# EAGLE design io_shield_v1.2 (EAGLE 5.11)
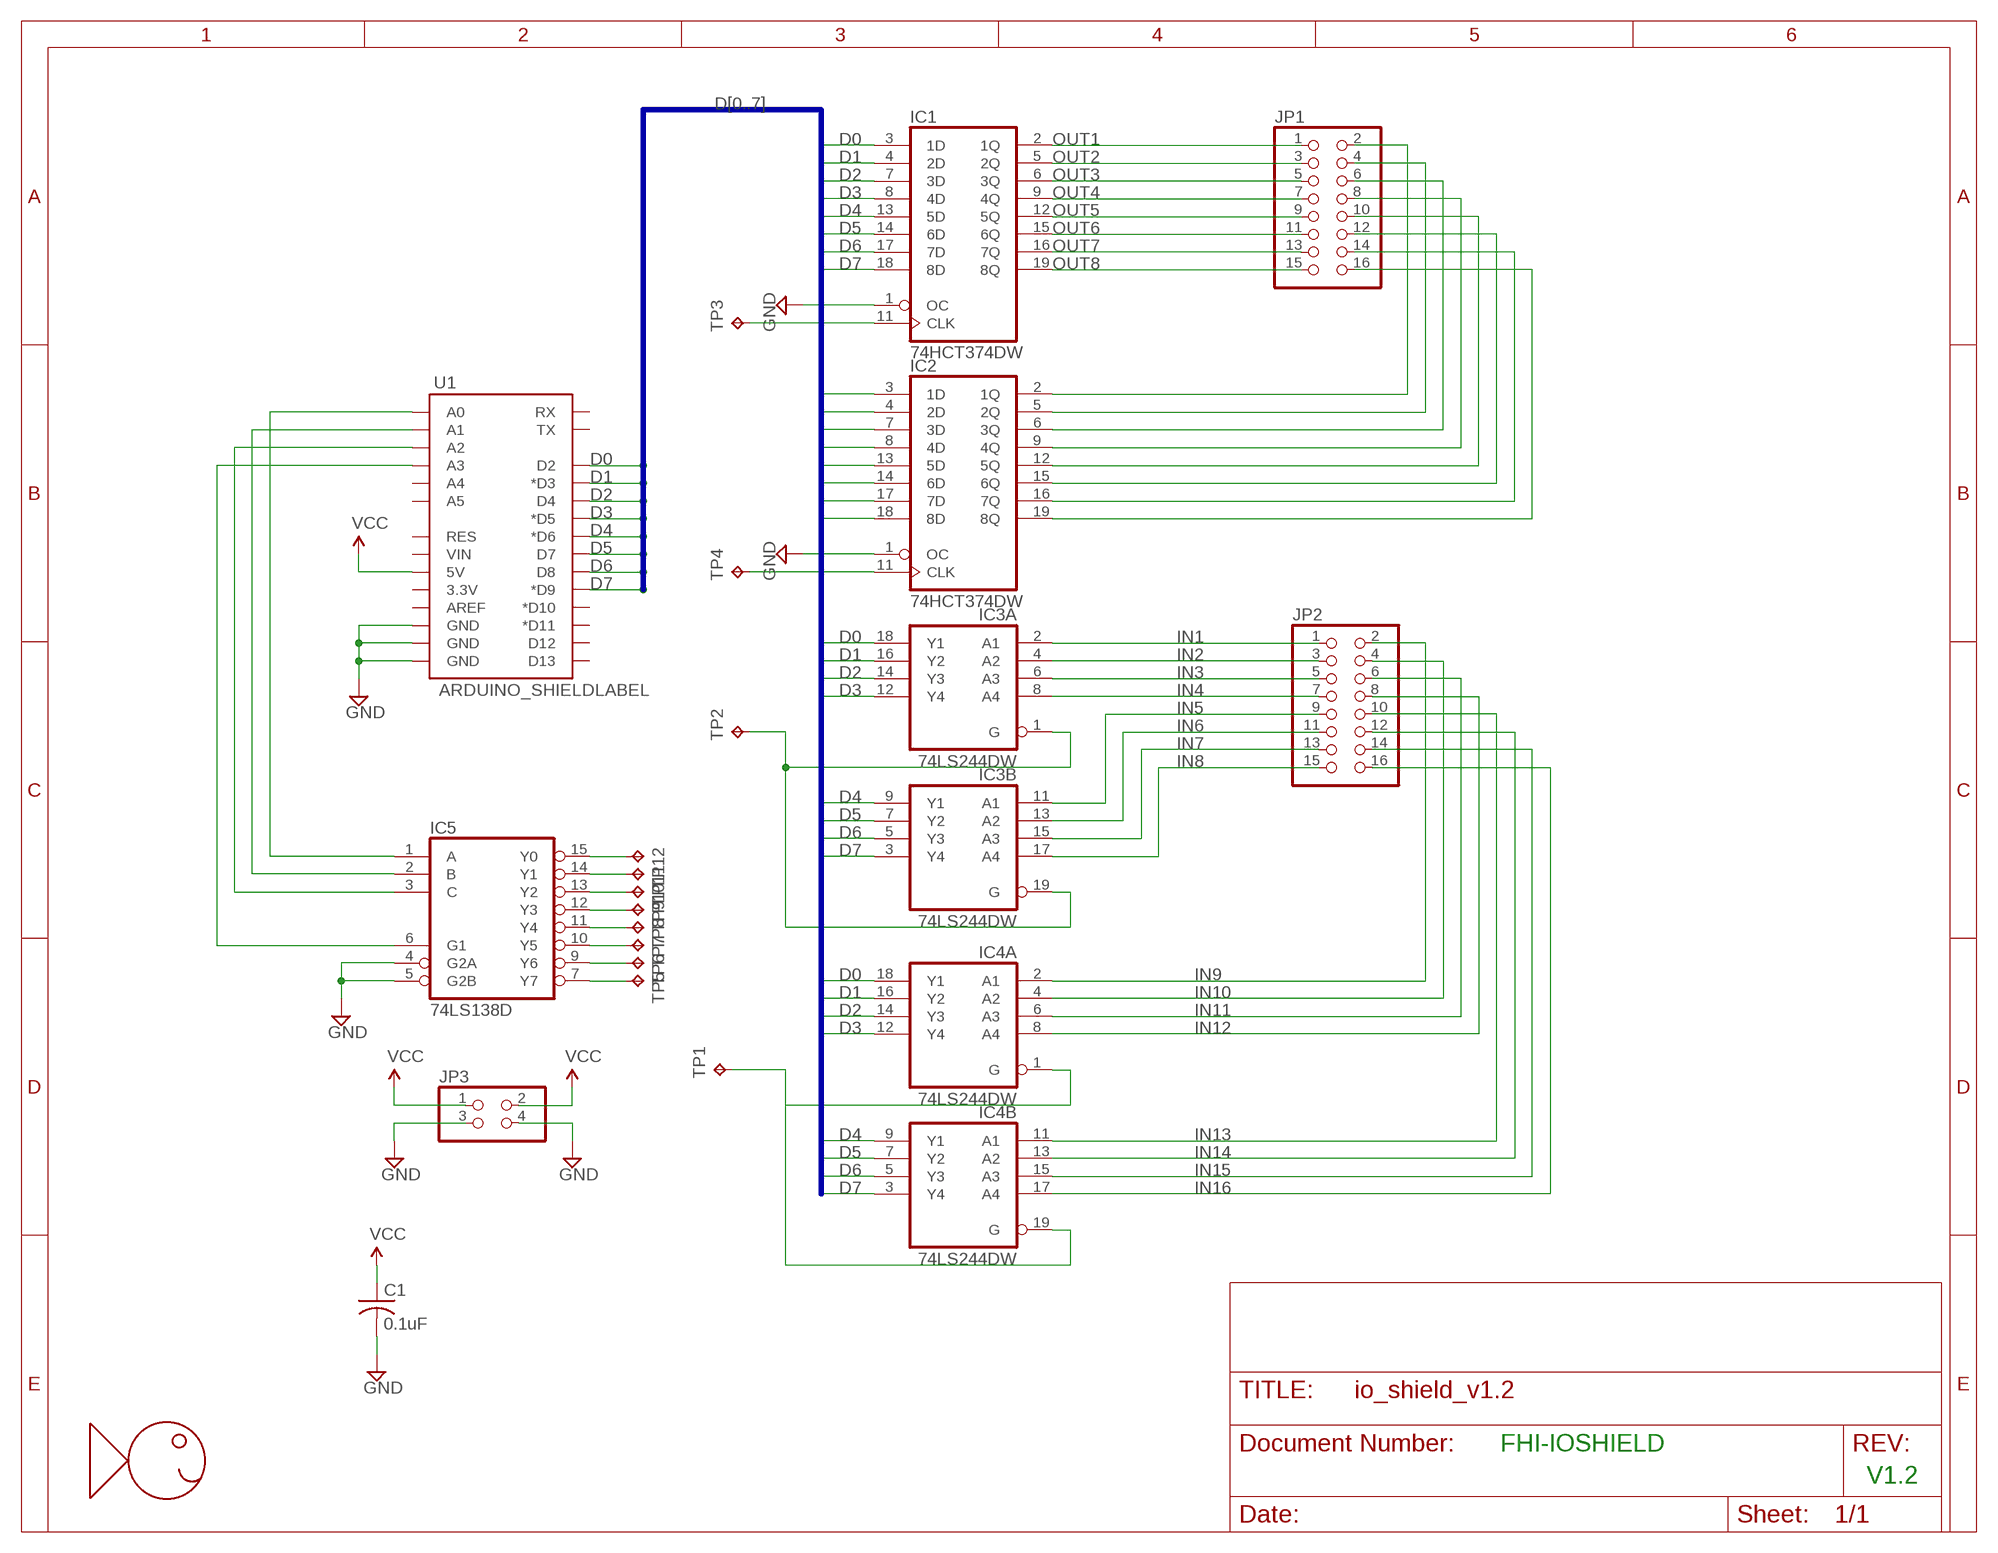
[diagram p0: schematic, sheet 1]

## Parts
C1  0.1uF  C-US025-025X050  [C025-025X050]
IC1  74HCT374DW  [SO20W]
IC2  74HCT374DW  [SO20W]
IC3  74LS244DW  [SO20W]
IC4  74LS244DW  [SO20W]
IC5  74LS138D  [SO16]
JP1  PINHD-2X8/90  [2X08/90]
JP2  PINHD-2X8/90  [2X08/90]
JP3  PINHD-2X2/90  [2X02/90]
TP1  TPTP12SQ  [TP12SQ]
TP2  TPTP12SQ  [TP12SQ]
TP3  TPTP12SQ  [TP12SQ]
TP4  TPTP12SQ  [TP12SQ]
TP5  TPTP12SQ  [TP12SQ]
TP6  TPTP12SQ  [TP12SQ]
TP7  TPTP12SQ  [TP12SQ]
TP8  TPTP12SQ  [TP12SQ]
TP9  TPTP12SQ  [TP12SQ]
TP10  TPTP12SQ  [TP12SQ]
TP11  TPTP12SQ  [TP12SQ]
TP12  TPTP12SQ  [TP12SQ]
U1  ARDUINO_SHIELDLABEL  [DUEMILANOVE_SHIELD]
U$1  FHI_LOGO  [FHI_LOGO]

## Nets
A0: IC5.1(A) U1.A0
A1: IC5.2(B) U1.A1
A2: IC5.3(C) U1.A2
D0: IC1.3(1D) IC2.3(1D) IC3.18(A:Y1) IC4.18(A:Y1) U1.D2
D1: IC1.4(2D) IC2.4(2D) IC3.16(A:Y2) IC4.16(A:Y2) U1.D3(*D3)
D2: IC1.7(3D) IC2.7(3D) IC3.14(A:Y3) IC4.14(A:Y3) U1.D4
D3: IC1.8(4D) IC2.8(4D) IC3.12(A:Y4) IC4.12(A:Y4) U1.D5(*D5)
D4: IC1.13(5D) IC2.13(5D) IC3.9(B:Y1) IC4.9(B:Y1) U1.D6(*D6)
D5: IC1.14(6D) IC2.14(6D) IC3.7(B:Y2) IC4.7(B:Y2) U1.D7
D6: IC1.17(7D) IC2.17(7D) IC3.5(B:Y3) IC4.5(B:Y3) U1.D8
D7: IC1.18(8D) IC2.18(8D) IC3.3(B:Y4) IC4.3(B:Y4) U1.D9(*D9)
EN0: IC5.15(Y0) TP12.TP
EN1: IC5.14(Y1) TP11.TP
EN2: IC5.13(Y2) TP10.TP
EN3: IC5.12(Y3) TP9.TP
EN4: IC5.11(Y4) TP8.TP
EN5: IC5.10(Y5) TP7.TP
EN6: IC5.9(Y6) TP6.TP
EN7: IC5.7(Y7) TP5.TP
GND: C1.2 IC1.1(OC) IC2.1(OC) IC5.4(G2A) IC5.5(G2B) JP3.3 JP3.4 U1.GND@0(GND) U1.GND@1(GND) U1.GND@2(GND)
IN1: IC3.2(A:A1) JP2.1
IN1_EN: IC3.1(A:G) IC3.19(B:G) TP2.TP
IN2: IC3.4(A:A2) JP2.3
IN2_EN: IC4.1(A:G) IC4.19(B:G) TP1.TP
IN3: IC3.6(A:A3) JP2.5
IN4: IC3.8(A:A4) JP2.7
IN5: IC3.11(B:A1) JP2.9
IN6: IC3.13(B:A2) JP2.11
IN7: IC3.15(B:A3) JP2.13
IN8: IC3.17(B:A4) JP2.15
IN9: IC4.2(A:A1) JP2.2
IN10: IC4.4(A:A2) JP2.4
IN11: IC4.6(A:A3) JP2.6
IN12: IC4.8(A:A4) JP2.8
IN13: IC4.11(B:A1) JP2.10
IN14: IC4.13(B:A2) JP2.12
IN15: IC4.15(B:A3) JP2.14
IN16: IC4.17(B:A4) JP2.16
IO_EN: IC5.6(G1) U1.A3
OUT1: IC1.2(1Q) JP1.1
OUT1_EN: IC1.11(CLK) TP3.TP
OUT2: IC1.5(2Q) JP1.3
OUT2_EN: IC2.11(CLK) TP4.TP
OUT3: IC1.6(3Q) JP1.5
OUT4: IC1.9(4Q) JP1.7
OUT5: IC1.12(5Q) JP1.9
OUT6: IC1.15(6Q) JP1.11
OUT7: IC1.16(7Q) JP1.13
OUT8: IC1.19(8Q) JP1.15
OUT9: IC2.2(1Q) JP1.2
OUT10: IC2.5(2Q) JP1.4
OUT11: IC2.6(3Q) JP1.6
OUT12: IC2.9(4Q) JP1.8
OUT13: IC2.12(5Q) JP1.10
OUT14: IC2.15(6Q) JP1.12
OUT15: IC2.16(7Q) JP1.14
OUT16: IC2.19(8Q) JP1.16
VCC: C1.1 JP3.1 JP3.2 U1.5V
Unconnected: U1.3.3V U1.A4 U1.A5 U1.AREF U1.D10(*D10) U1.D11(*D11) U1.D12 U1.D13 U1.RES U1.RX U1.TX U1.VIN

## Buses
D[0..7]

## Notes on the sheet
- FHI-IOSHIELD
- V1.2

## Power pins joined to a net without a drawn wire
GND: IC1.10(GND) IC2.10(GND) IC3.10(P:GND) IC4.10(P:GND) IC5.8(GND)
VCC: IC1.20(VCC) IC2.20(VCC) IC3.20(P:VCC) IC4.20(P:VCC) IC5.16(VCC)

## Library data of the parts
C1 = rcl:C-US: CAPACITOR, American symbol
IC1 IC2 = 74xx-eu:74*374: Octal D type transparent LATCH, edge triggered
IC3 IC4 = 74xx-us:74*244: Octal BUFFER and LINE DRIVER, 3-state
IC5 = 74xx-us:74*138: 3-line to 8-line DECODER/DEMULTIPLEXER
JP1 JP2 = pinhead:PINHD-2X8: PIN HEADER
JP3 = pinhead:PINHD-2X2: PIN HEADER
TP1-TP12 = testpad:TP: Test pad
U1 = SparkFun:ARDUINO_SHIELD
U$1 = CyberRailGuru:FHI_LOGO: Fishhead Industries Logo

## Board
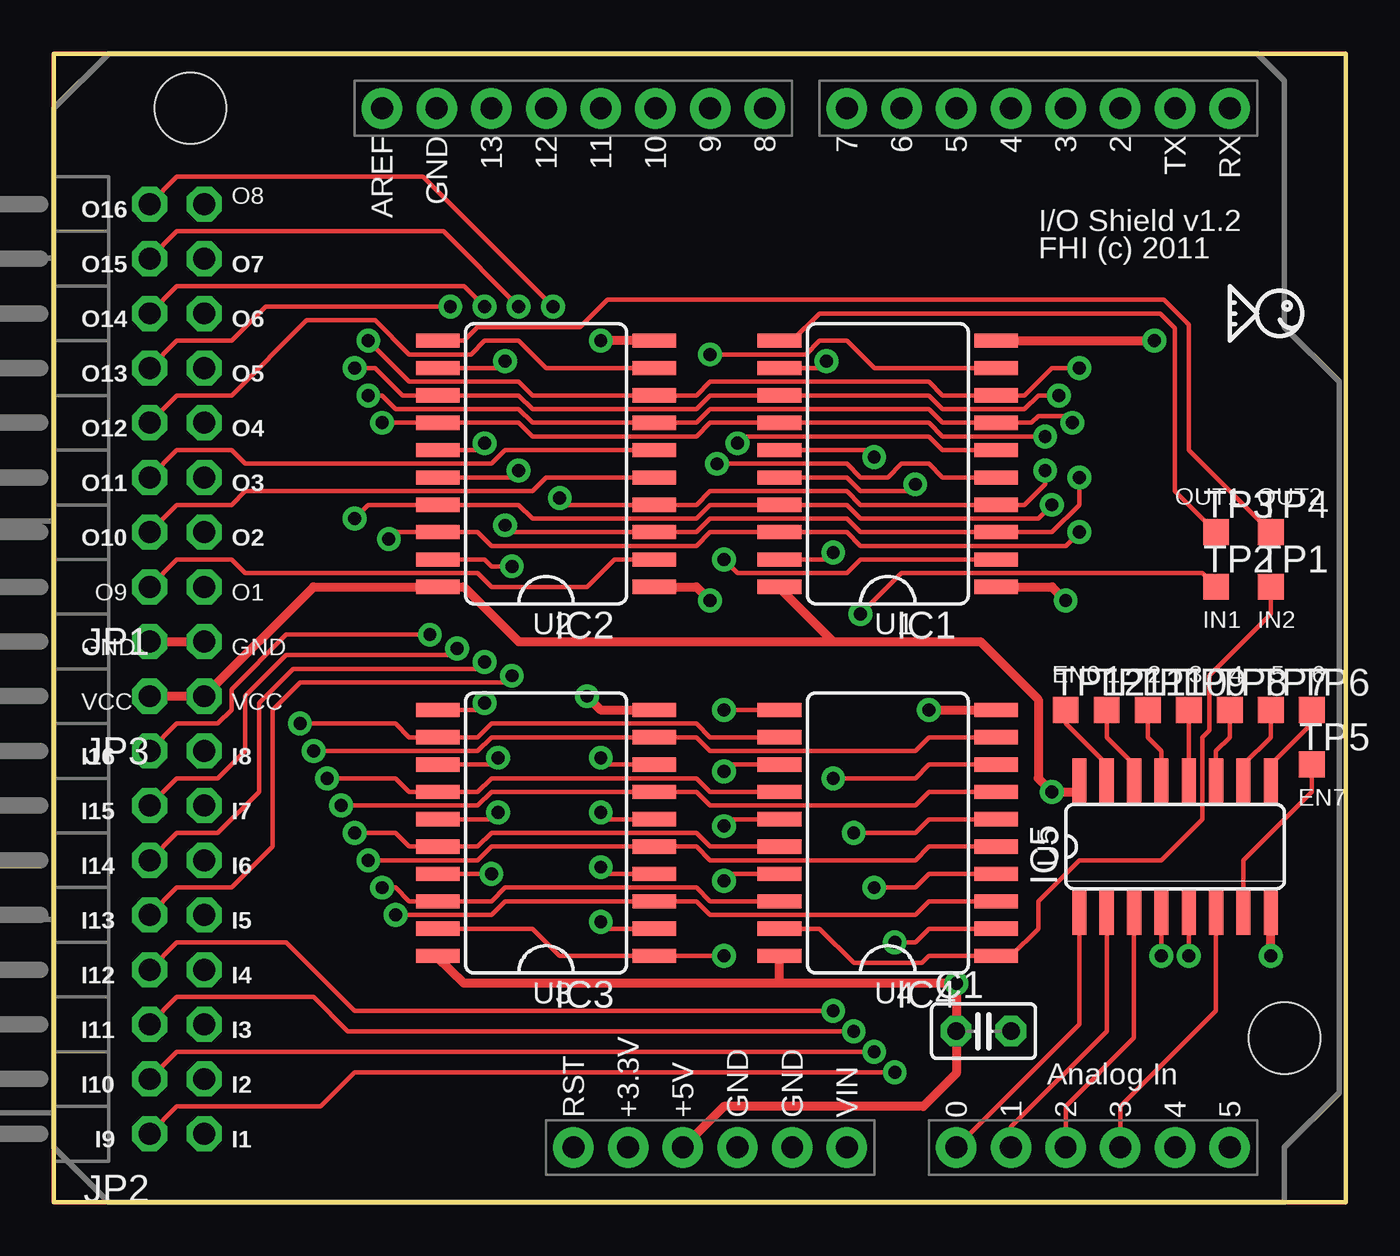
[diagram p1: board, top side]
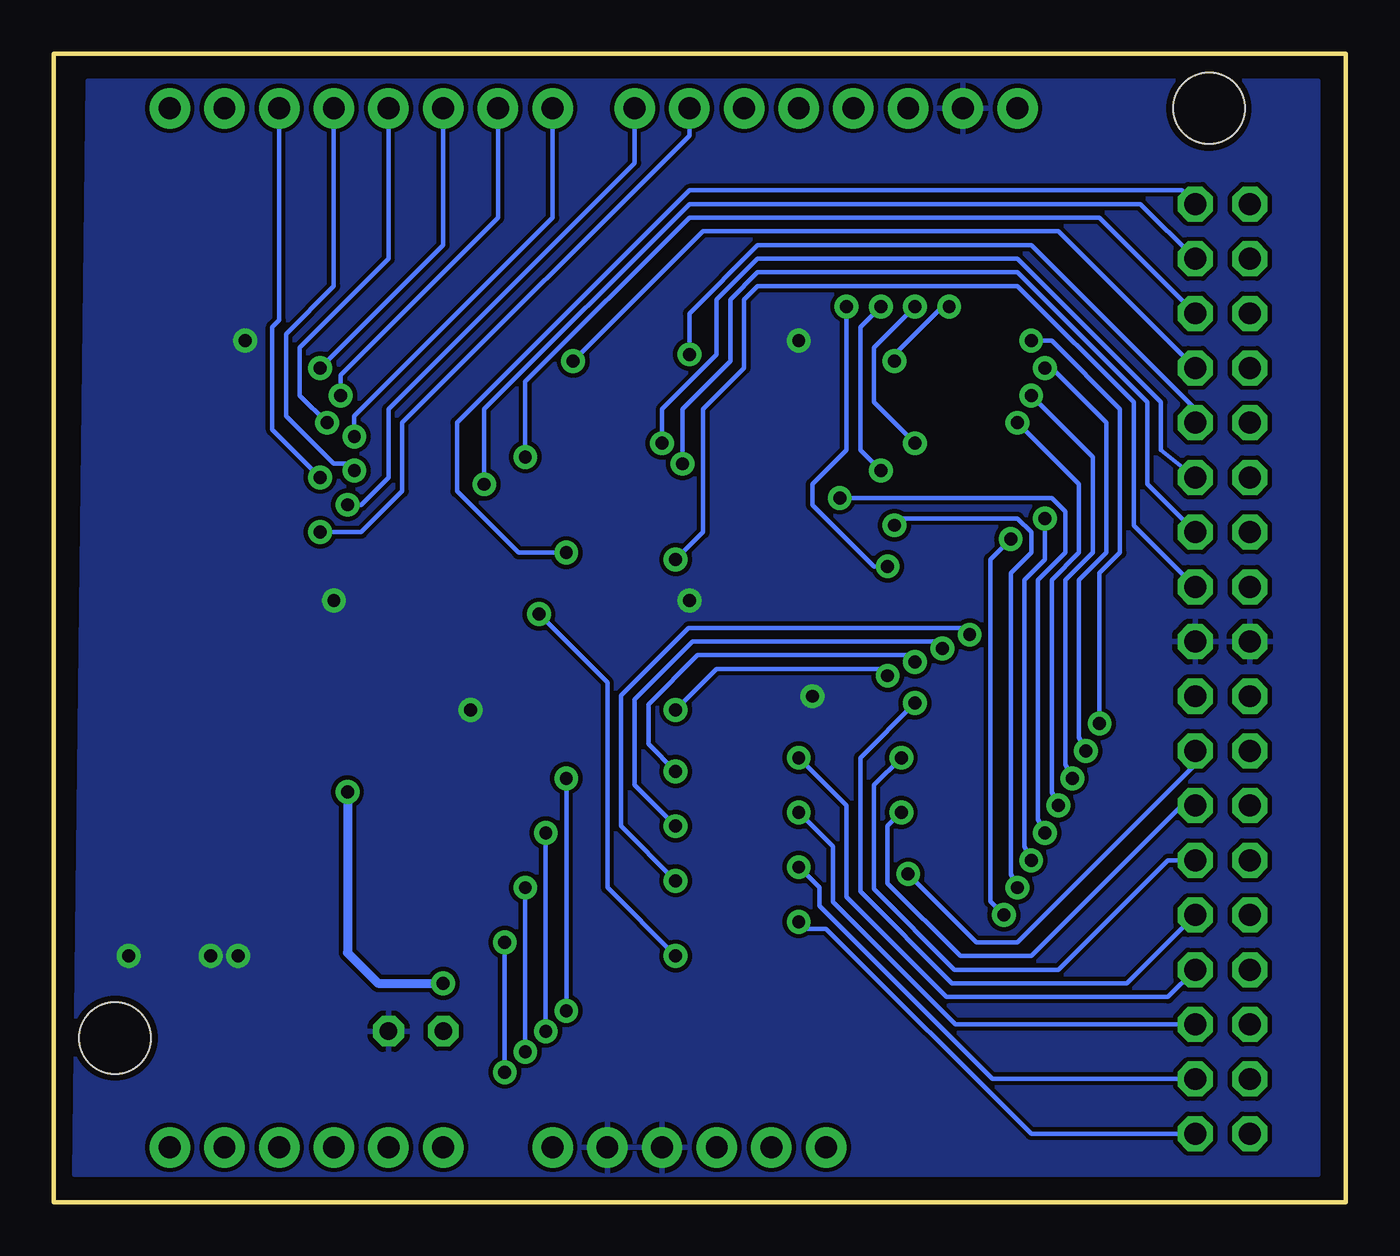
[diagram p2: board, bottom side, seen from below]

Size 59.99 x 53.33 mm. Coordinates in mm from the lower left corner, seen from the top.
Outline: 0,0 59.99,0 59.99,53.33 0,53.33 0,0
Copper layers (1*16): Top 0.035mm / dielectric 1.5mm / Bottom 0.035mm
Design rules "SparkFun_via *": minimum track width 8mil, minimum drill 20mil, track to track 8mil, track to pad 8mil, pad to pad 8mil, via to via 8mil, smd to smd 8mil, copper to edge 10mil, drill to drill 8mil, minimum pad ring 12mil, minimum via ring 10mil, stop-mask expansion 4mil, vias tented up to drill 25mil, thermal gap 10mil

### Footprints (pad centres in the part's own frame; a part is rotated, then mirrored left to right if it is on the bottom)
C025-025X050 = drill 0.813 octagon: 1 -1.27,0; 2 1.27,0
SO20W = smd 0.66 x 2.032: 1 -5.715,-5.029; 2 -4.445,-5.029; 3 -3.175,-5.029; 4 -1.905,-5.029; 5 -0.635,-5.029; 6 0.635,-5.029; 7 1.905,-5.029; 8 3.175,-5.029; 9 4.445,-5.029; 10 5.715,-5.029; 11 5.715,5.029; 12 4.445,5.029; 13 3.175,5.029; 14 1.905,5.029; 15 0.635,5.029; 16 -0.635,5.029; 17 -1.905,5.029; 18 -3.175,5.029; 19 -4.445,5.029; 20 -5.715,5.029
SO16 = smd 0.66 x 2.032: 1 -4.445,-3.073; 2 -3.175,-3.073; 3 -1.905,-3.073; 4 -0.635,-3.073; 5 0.635,-3.073; 6 1.905,-3.073; 7 3.175,-3.073; 8 4.445,-3.073; 9 4.445,3.073; 10 3.175,3.073; 11 1.905,3.073; 12 0.635,3.073; 13 -0.635,3.073; 14 -1.905,3.073; 15 -3.175,3.073; 16 -4.445,3.073
2X08/90 = drill 1.016 octagon: 1 -8.89,-6.35; 2 -8.89,-3.81; 3 -6.35,-6.35; 4 -6.35,-3.81; 5 -3.81,-6.35; 6 -3.81,-3.81; 7 -1.27,-6.35; 8 -1.27,-3.81; 9 1.27,-6.35; 10 1.27,-3.81; 11 3.81,-6.35; 12 3.81,-3.81; 13 6.35,-6.35; 14 6.35,-3.81; 15 8.89,-6.35; 16 8.89,-3.81
2X02/90 = drill 1.016 octagon: 1 -1.27,-6.35; 2 -1.27,-3.81; 3 1.27,-6.35; 4 1.27,-3.81
TP12SQ = smd 1.2 x 1.2: TP 0,0
DUEMILANOVE_SHIELD = drill 1.016 pad 1.88 round: 3.3V 50.8,26.67; 5V 50.8,29.21; A0 50.8,41.91; A1 50.8,44.45; A2 50.8,46.99; A3 50.8,49.53; A4 50.8,52.07; A5 50.8,54.61; AREF 2.54,15.24; D2 2.54,49.53; D3 2.54,46.99; D4 2.54,44.45; D5 2.54,41.91; D6 2.54,39.37; D7 2.54,36.83; D8 2.54,33.02; D9 2.54,30.48; D10 2.54,27.94; D11 2.54,25.4; D12 2.54,22.86; D13 2.54,20.32; GND@0 50.8,31.75; GND@1 50.8,34.29; GND@2 2.54,17.78; RES 50.8,24.13; RX 2.54,54.61; TX 2.54,52.07; VIN 50.8,36.83 | hole 3.302: 45.72,57.15; 2.54,6.35

### Placement (x,y rotation side)
C1  43.18,7.94 0 top
IC1  38.73,34.29 90 top
IC2  22.86,34.29 90 top
IC3  22.86,17.14 90 top
IC4  38.73,17.14 90 top
IC5  52.07,16.51 0 top
JP1  0.64,37.47 90 top
JP2  0.64,12.06 90 top
JP3  0.64,24.77 90 top
TP1  56.52,28.57 0 top
TP2  53.98,28.57 0 top
TP3  53.98,31.11 0 top
TP4  56.52,31.11 0 top
TP5  58.42,20.32 0 top
TP6  58.42,22.86 0 top
TP7  56.52,22.86 0 top
TP8  54.61,22.86 0 top
TP9  52.7,22.86 0 top
TP10  50.8,22.86 0 top
TP11  48.9,22.86 0 top
TP12  46.99,22.86 0 top
U1  0,53.34 270 top
U$1  55.88,41.27 0 top

### Tracks (layer width: path | path; a pad name or v marks a point on that pad's centre or on a via)
A0
  Top 0.203: IC5.1 47.62,8.26 U1.A0
A1
  Top 0.203: IC5.2 48.9,7.94 44.45,3.49 U1.A1
A2
  Top 0.203: U1.A2 46.99,4.45 50.16,7.62 IC5.3
D0  (via drill 0.6)
  Top 0.203: IC4.18 30.48,13.97 29.84,14.61 20.95,14.61 20.32,13.97 IC3.18 16.51,13.97 15.88,14.61 v15.24,14.61 | v20.95,31.43 21.27,31.11 IC2.3 29.84,31.11 30.48,31.75 36.83,31.75 37.47,31.11 IC1.3 46.35,31.11 47.62,32.38 v47.62,33.66
  Bottom 0.203: v47.62,33.66 49.85,35.88 49.85,40.64 49.53,40.96 U1.D2 | v20.95,31.43 20.64,31.75 15.24,31.75 14.61,31.11 14.61,30.16 15.56,29.21 15.56,15.24 v15.24,14.61
D1  (via drill 0.6)
  Top 0.203: IC4.16 30.48,16.51 29.84,17.14 20.32,17.14 19.68,16.51 IC3.16 16.51,16.51 15.88,17.14 v13.97,17.14 | v46.04,33.97 46.04,33.34 45.09,32.38 IC1.4 37.47,32.38 36.83,33.02 30.48,33.02 29.84,32.38 IC2.4 23.81,32.38 v23.5,32.7
  Bottom 0.203: v13.97,17.14 14.29,17.78 14.29,28.89 13.02,30.16 13.02,32.07 13.65,32.7 v23.5,32.7 | v46.04,33.97 46.35,34.29 46.99,34.29 49.21,36.51 49.21,40.32 46.99,42.55 U1.D3
D2  (via drill 0.6)
  Top 0.203: IC4.14 30.48,19.05 29.84,19.68 20.32,19.68 19.68,19.05 IC3.14 16.51,19.05 15.88,19.68 v12.7,19.68 | v47.31,36.2 46.99,36.51 45.72,36.51 45.4,36.2 IC1.7 41.27,36.2 40.64,36.83 30.48,36.83 29.84,36.2 IC2.7 22.23,36.2 21.59,36.83 15.88,36.83 15.24,37.47 v14.61,37.47
  Bottom 0.203: v47.31,36.2 48.58,37.47 48.58,39.69 44.45,43.81 U1.D4 | v12.7,19.68 13.02,20.32 13.02,28.89 11.75,30.16 11.75,34.61 v14.61,37.47
D3  (via drill 0.6)
  Top 0.203: v47.62,38.73 46.35,38.73 45.09,37.47 IC1.8 41.27,37.47 40.64,38.1 30.48,38.1 29.84,37.47 IC2.8 22.23,37.47 21.59,38.1 16.51,38.1 v14.61,40.01 | IC4.12 30.48,21.59 29.84,22.23 20.32,22.23 19.68,21.59 IC3.12 16.51,21.59 15.88,22.23 v11.43,22.23
  Bottom 0.203: v11.43,22.23 11.43,29.21 10.48,30.16 10.48,36.83 13.65,40.01 v14.61,40.01 | v47.62,38.73 41.91,44.45 U1.D5
D4  (via drill 0.6)
  Top 0.203: IC4.9 40.64,21.59 40.01,20.95 30.48,20.95 29.84,21.59 IC3.9 20.32,21.59 19.68,20.95 v12.06,20.95 | v46.67,37.47 45.72,37.47 45.09,36.83 41.27,36.83 40.64,37.47 IC1.13 30.48,37.47 29.84,36.83 22.23,36.83 21.59,37.47 IC2.13 16.19,37.47 14.92,38.73 v13.97,38.73
  Bottom 0.203: v12.06,20.95 12.38,21.59 12.38,28.89 11.11,30.16 11.11,36.2 13.65,38.73 v13.97,38.73 | v46.67,37.47 46.67,38.42 39.37,45.72 U1.D6
D5  (via drill 0.6)
  Top 0.203: IC4.7 40.64,19.05 40.01,18.41 30.48,18.41 29.84,19.05 IC3.7 20.32,19.05 19.68,18.41 v13.34,18.41 | v46.04,35.56 41.27,35.56 40.64,36.2 IC1.14 30.48,36.2 29.84,35.56 22.23,35.56 21.59,36.2 IC2.14 v15.24,36.2
  Bottom 0.203: v13.34,18.41 13.65,19.05 13.65,28.89 12.38,30.16 12.38,33.34 v15.24,36.2 | v46.04,35.56 46.04,36.51 36.83,45.72 U1.D7
D6  (via drill 0.6)
  Top 0.203: IC4.5 40.64,16.51 40.01,15.88 30.48,15.88 29.84,16.51 IC3.5 20.32,16.51 19.68,15.88 v14.61,15.88 | v46.35,32.38 45.72,31.75 37.47,31.75 36.83,32.38 IC1.17 30.48,32.38 29.84,31.75 22.23,31.75 21.59,32.38 IC2.17 14.61,32.38 v13.97,31.75
  Bottom 0.203: v14.61,15.88 14.92,16.51 14.92,28.89 13.97,29.84 v13.97,31.75 | U1.D8 33.02,48.26 44.45,36.83 44.45,33.66 45.72,32.38 v46.35,32.38
D7  (via drill 0.6)
  Top 0.203: IC4.3 40.64,13.97 40.01,13.34 30.48,13.34 29.84,13.97 IC3.3 20.95,13.97 20.32,13.34 v15.88,13.34 | v47.62,31.11 46.99,30.48 37.47,30.48 36.83,31.11 IC1.18 30.48,31.11 29.84,30.48 20.32,30.48 19.68,31.11 IC2.18 15.88,31.11 v15.56,30.8
  Bottom 0.203: v15.88,13.34 16.51,13.97 16.51,29.84 v15.56,30.8 | U1.D9 30.48,49.53 43.81,36.2 43.81,33.02 45.72,31.11 v47.62,31.11
EN0
  Top 0.203: IC5.15 48.9,20.32 46.99,22.23 TP12.TP
EN1
  Top 0.203: IC5.14 50.16,20.32 48.9,21.59 TP11.TP
EN2
  Top 0.203: IC5.13 51.44,20.95 50.8,21.59 TP10.TP
EN3
  Top 0.203: IC5.12 TP9.TP
EN4
  Top 0.203: IC5.11 53.98,20.95 54.61,21.59 TP8.TP
EN5
  Top 0.203: IC5.10 55.24,20.32 56.52,21.59 TP7.TP
EN6
  Top 0.203: IC5.9 56.52,20.32 58.42,22.23 TP6.TP
EN7
  Top 0.203: IC5.7 55.24,15.88 58.42,19.05 TP5.TP
GND  (via drill 0.6)
  Top 0.203: v52.7,11.43 IC5.5 | v51.44,11.43 IC5.4
  Top 0.406: IC1.10 v51.12,40.01 | v56.52,11.43 IC5.8 | IC2.10 v25.4,40.01 | IC2.1 29.84,28.57 v30.48,27.94 | IC3.10 25.4,22.86 v24.77,23.5 | JP3.4 JP3.3 | v40.64,22.86 IC4.10 | IC1.1 46.35,28.57 v46.99,27.94
  pour Bottom: 1.27,1.27 59.05,1.27 58.42,52.07 1.27,52.07
IN1  (via drill 0.6)
  Top 0.203: IC3.2 25.72,12.7 v25.4,13.02
  Bottom 0.203: JP2.1 14.61,3.17 24.13,12.7 25.08,12.7 v25.4,13.02
IN1_EN  (via drill 0.6)
  Top 0.203: IC3.19 22.23,12.7 23.5,11.43 IC3.1 v31.11,11.43 | v37.47,27.3 39.37,29.21 53.34,29.21 TP2.TP
  Bottom 0.203: v37.47,27.3 34.29,24.13 34.29,14.61 v31.11,11.43
IN2  (via drill 0.6)
  Top 0.203: IC3.4 25.72,15.24 v25.4,15.56
  Bottom 0.203: JP2.3 16.4,5.71 24.45,13.76 24.45,14.61 v25.4,15.56
IN2_EN
  Top 0.203: IC4.19 35.56,12.7 37.15,11.11 40.32,11.11 40.64,11.43 IC4.1 44.45,11.43 45.72,12.7 45.72,13.97 47.62,15.88 51.44,15.88 53.34,17.78 53.34,21.59 53.66,21.91 53.66,24.45 56.52,27.3 TP1.TP
IN3  (via drill 0.6)
  Top 0.203: IC3.6 25.72,17.78 v25.4,18.1
  Bottom 0.203: v25.4,18.1 23.81,16.51 23.81,13.95 18.12,8.26 JP2.5
IN4  (via drill 0.6)
  Top 0.203: IC3.8 25.72,20.32 v25.4,20.64
  Bottom 0.203: v25.4,20.64 23.18,18.41 23.18,14.16 18.54,9.53 8.26,9.53 JP2.7
IN5  (via drill 0.6)
  Top 0.203: IC3.11 19.68,22.86 v20,23.18
  Bottom 0.203: v20,23.18 22.54,20.64 22.54,14.42 18.28,10.16 10.16,10.16 JP2.9
IN6  (via drill 0.6)
  Top 0.203: IC3.13 20.32,20.32 v20.64,20.64
  Bottom 0.203: v20.64,20.64 21.91,19.37 21.91,14.54 18.16,10.79 13.34,10.79 8.26,15.88 JP2.11
IN7  (via drill 0.6)
  Top 0.203: IC3.15 20.32,17.78 v20.64,18.1
  Bottom 0.203: v20.64,18.1 21.27,17.46 21.27,14.81 17.89,11.43 14.61,11.43 7.62,18.41 JP2.13
IN8  (via drill 0.6)
  Top 0.203: v20.32,15.24 IC3.17
  Bottom 0.203: v20.32,15.24 17.14,12.06 15.24,12.06 6.99,20.32 JP2.15
IN9  (via drill 0.6)
  Top 0.203: IC4.2 40.64,12.7 40.01,12.06 v39.05,12.06 | v39.05,6.03 13.97,6.03 12.38,4.45 5.71,4.45 JP2.2
  Bottom 0.203: v39.05,6.03 v39.05,12.06
IN10  (via drill 0.6)
  Top 0.203: IC4.4 40.64,15.24 40.01,14.61 v38.1,14.61 | v38.1,6.99 5.71,6.99 JP2.4
  Bottom 0.203: v38.1,6.99 v38.1,14.61
IN11  (via drill 0.6)
  Top 0.203: IC4.6 40.64,17.78 40.01,17.14 v37.15,17.14 | v37.15,7.94 13.65,7.94 12.06,9.53 5.71,9.53 JP2.6
  Bottom 0.203: v37.15,7.94 v37.15,17.14
IN12  (via drill 0.6)
  Top 0.203: IC4.8 40.64,20.32 40.01,19.68 v36.2,19.68 | v36.2,8.89 13.97,8.89 10.79,12.06 5.71,12.06 JP2.8
  Bottom 0.203: v36.2,8.89 v36.2,19.68
IN13  (via drill 0.6)
  Top 0.203: v31.11,22.86 IC4.11 | v21.27,24.45 20.95,24.13 11.43,24.13 10.16,22.86 10.16,16.51 8.26,14.61 5.71,14.61 JP2.10
  Bottom 0.203: v31.11,22.86 29.21,24.77 21.59,24.77 v21.27,24.45
IN14  (via drill 0.6)
  Top 0.203: v20,25.08 19.68,24.77 11.11,24.77 9.53,23.18 9.53,19.05 7.62,17.14 5.71,17.14 JP2.12 | IC4.13 31.43,20.32 v31.11,20
  Bottom 0.203: v20,25.08 20.32,25.4 30.1,25.4 32.38,23.11 32.38,21.27 v31.11,20
IN15  (via drill 0.6)
  Top 0.203: v18.73,25.72 18.41,25.4 10.79,25.4 8.89,23.5 8.89,20.95 7.62,19.68 5.71,19.68 JP2.14 | IC4.15 31.43,17.78 v31.11,17.46
  Bottom 0.203: v18.73,25.72 19.05,26.04 30.33,26.04 33.02,23.34 33.02,19.37 v31.11,17.46
IN16  (via drill 0.6)
  Top 0.203: IC4.17 31.43,15.24 v31.11,14.92 | v17.46,26.35 10.79,26.35 8.26,23.81 8.26,22.86 7.62,22.23 5.71,22.23 JP2.16
  Bottom 0.203: v17.46,26.35 17.78,26.67 30.51,26.67 33.66,23.53 33.66,17.46 v31.11,14.92
IO_EN
  Top 0.203: IC5.6 53.98,8.89 49.53,4.45 U1.A3
OUT1  (via drill 0.6)
  Top 0.203: IC1.2 37.47,29.84 36.83,29.21 31.75,29.21 v31.11,29.84
  Bottom 0.203: JP1.1 9.84,31.43 9.84,37.15 15.24,42.55 27.3,42.55 27.94,41.91 27.94,38.73 29.84,36.83 29.84,31.11 v31.11,29.84 30.8,30.16
OUT1_EN
  Top 0.203: TP3.TP 52.07,33.02 52.07,40.59 51.39,41.27 35.56,41.27 34.29,40.01 IC1.11
OUT2  (via drill 0.6)
  Top 0.203: IC1.5 41.27,33.66 40.64,34.29 39.37,34.29 38.73,33.66 37.47,33.66 36.83,34.29 v30.8,34.29
  Bottom 0.203: JP1.3 9.21,33.34 9.21,37.15 15.24,43.18 27.3,43.18 28.57,41.91 28.57,39.05 30.8,36.83 v30.8,34.29
OUT2_EN
  Top 0.203: IC2.11 19.05,40.01 19.68,40.64 24.45,40.64 25.72,41.91 51.56,41.91 52.7,40.76 52.7,34.92 TP4.TP
OUT3  (via drill 0.6)
  Top 0.203: IC1.6 41.27,34.92 40.64,35.56 32.07,35.56 v31.75,35.24
  Bottom 0.203: JP1.5 8.57,34.92 8.57,37.15 15.24,43.81 27.3,43.81 29.21,41.91 29.21,39.37 31.75,36.83 v31.75,35.24
OUT4  (via drill 0.6)
  Top 0.203: IC1.9 38.1,38.73 36.83,40.01 35.56,40.01 34.92,39.37 v30.48,39.37
  Bottom 0.203: JP1.7 6.99,36.83 14.61,44.45 27.3,44.45 30.48,41.27 v30.48,39.37
OUT5  (via drill 0.6)
  Top 0.203: IC1.12 35.56,38.73 v35.88,39.05
  Bottom 0.203: v35.88,39.05 29.84,45.09 13.34,45.09 JP1.9
OUT6  (via drill 0.6)
  Top 0.203: IC1.15 37.78,34.92 v38.1,34.61
  Bottom 0.203: v38.1,34.61 38.1,38.1 30.48,45.72 11.43,45.72 JP1.11
OUT7  (via drill 0.6)
  Top 0.203: IC1.16 36.83,33.66 37.47,33.02 39.69,33.02 v40.01,33.34
  Bottom 0.203: v40.01,33.34 40.01,36.83 30.48,46.35 9.53,46.35 JP1.13
OUT8  (via drill 0.6)
  Top 0.203: IC1.19 35.88,29.84 v36.2,30.16
  Bottom 0.203: v36.2,30.16 38.42,30.16 41.27,33.02 41.27,36.2 30.48,46.99 7.62,46.99 JP1.15
OUT9
  Top 0.203: IC2.2 26.04,29.84 24.77,28.57 20.32,28.57 19.68,29.21 8.89,29.21 8.26,29.84 5.71,29.84 JP1.2
OUT10
  Top 0.203: IC2.5 22.86,33.66 22.23,33.02 8.89,33.02 8.26,32.38 5.71,32.38 JP1.4
OUT11
  Top 0.203: IC2.6 20.95,34.92 20.32,34.29 8.89,34.29 8.26,34.92 5.71,34.92 JP1.6
OUT12
  Top 0.203: JP1.8 5.71,37.47 8.26,37.47 11.75,40.96 14.92,40.96 16.51,39.37 19.37,39.37 20,40.01 21.59,40.01 22.86,38.73 IC2.9
OUT13  (via drill 0.6)
  Top 0.203: v18.41,41.59 9.84,41.59 8.26,40.01 5.71,40.01 JP1.10 | v20.95,39.05 20.64,38.73 IC2.12
  Bottom 0.203: v18.41,41.59 18.73,41.59 20.95,39.37 v20.95,39.05
OUT14  (via drill 0.6)
  Top 0.203: IC2.15 19.68,34.92 v20,35.24 | JP1.12 5.71,42.55 19.05,42.55 v20,41.59
  Bottom 0.203: v20,35.24 21.91,37.15 21.91,39.69 v20,41.59
OUT15  (via drill 0.6)
  Top 0.203: JP1.14 5.71,45.09 18.1,45.09 v21.59,41.59 | IC2.16 21.27,33.66 v21.59,33.97
  Bottom 0.203: v21.59,33.97 22.54,34.92 22.54,40.64 v21.59,41.59
OUT16  (via drill 0.6)
  Top 0.203: IC2.19 20,29.84 20.32,29.53 v21.27,29.53 | JP1.16 5.71,47.62 17.14,47.62 v23.18,41.59
  Bottom 0.203: v21.27,29.53 21.91,29.53 24.77,32.38 24.77,33.34 23.18,34.92 v23.18,41.59
VCC  (via drill 0.6)
  Top 0.406: IC1.20 33.66,28.52 33.71,28.52 36.2,26.04 | IC4.20 33.71,10.21 33.66,10.16 | 33.66,10.16 19.05,10.16 17.78,11.38 IC3.20 | 33.66,10.16 v41.91,10.16 C1.1 41.91,5.98 40.38,4.45 31.11,4.45 U1.5V | 47.62,19.68 IC5.16 47.62,19.05 v46.35,19.05 45.72,19.68 45.72,23.34 43.03,26.04 36.2,26.04 | 36.2,26.04 21.59,26.04 19.05,28.57 IC2.20 12.06,28.57 JP3.1 JP3.2
  Bottom 0.406: v46.35,19.05 46.35,11.58 44.94,10.16 v41.91,10.16

### Text on the board
tPlace: O16 | O8 | I/O Shield v1.2 | FHI (c) 2011 | O15 | O7 | O14 | O6 | O13 | O5 | O12 | O4 | O11 | O3 | OUT1 | OUT2 | O10 | O2 | O9 | O1 | IN1 | IN2 | U2 | U1 | GND | GND | EN0 | 1 | 2 | 3 | 4 | 5 | 6 | VCC | VCC | I16 | I8 | I15 | I7 | EN7 | U5 | I14 | I6 | I13 | I5 | I12 | I4 | U3 | U4 | I11 | I3 | I10 | I2 | I9 | I1